# EAGLE design power_module (EAGLE 4.16)
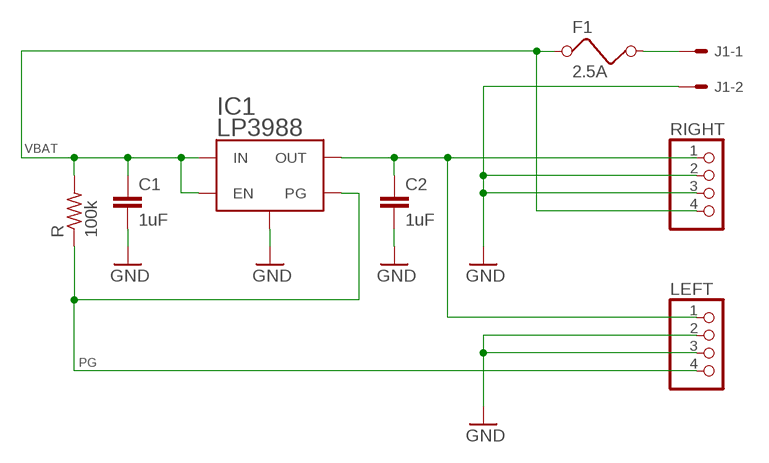
[diagram p0: schematic, sheet 1]

## Parts
C1  1uF  C-EUC3216  [C3216]
C2  1uF  C-EUC3216  [C3216]
F1  2.5A  POLYSWITCH_5MM  [POLYSWITCH_5MM]
IC1  LP3988  [SOT-23-5]
J1  S2P-S  [2P-S]
LEFT  PINHD-1X4  [1X04]
R  100k  R-US_R2012  [R2012]
RIGHT  PINHD-1X4  [1X04]

## Nets
GND: C1.2 C2.2 IC1.P$2(GND) J1.2 LEFT.2 LEFT.3 RIGHT.2 RIGHT.3
N$1: C2.1 IC1.P$5(OUT) LEFT.1 RIGHT.1
N$2: F1.P$2 J1.1
PG: IC1.P$4(PG) LEFT.4 R.1
VBAT: C1.1 F1.P$1 IC1.P$1(IN) IC1.P$3(EN) R.2 RIGHT.4

## Library data of the parts
C1 C2 = rcl:C-EU: CAPACITOR, European symbol
F1 = ptc_tyco:POLYSWITCH_5MM
IC1 = v-regulator_lp3988:LP3988
J1 = 1-conn-jst:S2P
LEFT RIGHT = pinhead:PINHD-1X4: PIN HEADER
R = rcl:R-US_: RESISTOR, American symbol

## Board
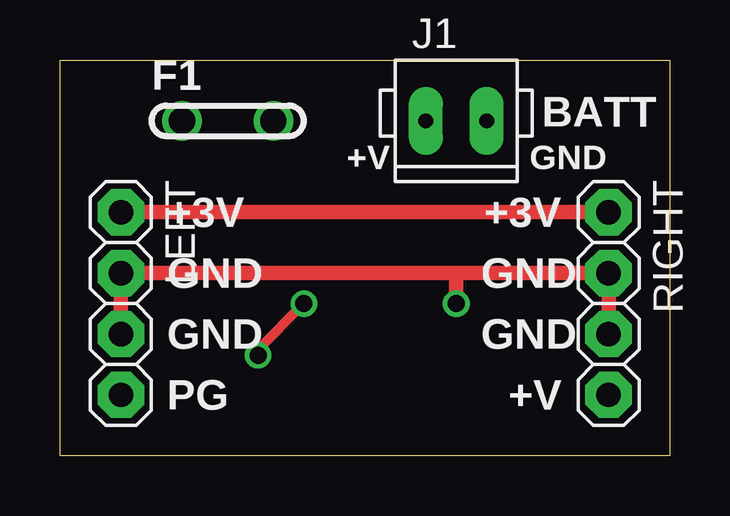
[diagram p1: board, top side]
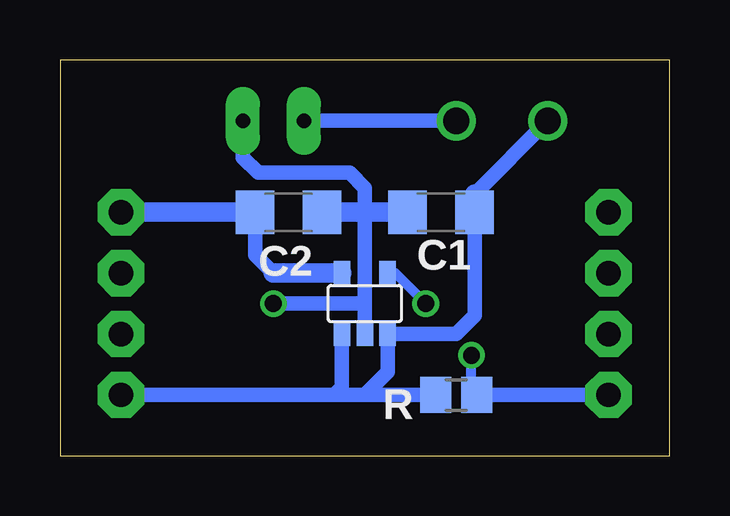
[diagram p2: board, bottom side, seen from below]

Size 25.4 x 16.51 mm. Coordinates in mm from the lower left corner, seen from the top.
Outline: 0,0 0,16.51 25.4,16.51 25.4,0 0,0
Copper layers (1*16): Top 0.035mm / dielectric 1.5mm / Bottom 0.035mm
Design rules "8mils": minimum track width 10mil, minimum drill 24mil, track to track 8mil, track to pad 8mil, pad to pad 8mil, via to via 8mil, smd to smd 8mil, copper to edge 40mil, drill to drill 10mil, minimum pad ring 10mil, minimum via ring 8mil, stop-mask expansion 0mil, vias tented up to drill 0mil, thermal gap 10mil

### Footprints (pad centres in the part's own frame; a part is rotated, then mirrored left to right if it is on the bottom)
C3216 = smd 1.6 x 1.8: 1 -1.4,0; 2 1.4,0
POLYSWITCH_5MM = drill 1.092 round: P$1 -1.27,0; P$2 2.54,0
SOT-23-5 = smd 0.686 x 0.991: P$1 -0.953,-1.27; P$2 0,-1.27; P$3 0.953,-1.27; P$4 0.953,1.27; P$5 -0.953,1.27
2P-S = drill 0.61 pad 1.422 long: 1 -1.27,0; 2 1.27,0
1X04 = drill 1.016 pad 1.93 octagon: 1 -3.81,0; 2 -1.27,0; 3 1.27,0; 4 3.81,0
R2012 = smd 1.3 x 1.5: 1 -0.85,0; 2 0.85,0

### Placement (x,y rotation side)
C1  9.53,10.16 180 bottom
C2  15.88,10.16 0 bottom
F1  6.35,13.97 0 top
IC1  12.7,6.35 0 bottom
J1  16.51,13.97 0 top
LEFT  2.54,6.35 270 top
R  8.89,2.54 180 bottom
RIGHT  22.86,6.35 270 top

### Tracks (layer width: path | path; a pad name or v marks a point on that pad's centre or on a via)
GND  (via drill 0.7)
  Top 0.61: LEFT.3 LEFT.2 16.51,7.62 | RIGHT.3 RIGHT.2 16.51,7.62 | 16.51,7.62 v16.51,6.35
  Bottom 0.61: 12.7,6.35 IC1.P$2 | 12.7,6.35 12.7,10.16 12.7,11.18 13.34,11.81 17.14,11.81 17.78,12.45 J1.2 | v16.51,6.35 12.7,6.35
  Bottom 0.813: C2.2 12.7,10.16 C1.2
N$1
  Top 0.61: LEFT.1 RIGHT.1
  Bottom 0.61: C2.1 17.27,8.38 16.51,7.62
  Bottom 0.813: 16.51,7.62 IC1.P$5 | RIGHT.1 C2.1
N$2
  Bottom 0.61: J1.1 F1.P$2
PG  (via drill 0.7)
  Top 0.406: v8.25,4.19 8.25,4.45 v10.16,6.35
  Bottom 0.406: IC1.P$4 11.43,7.62 v10.16,6.35 | R.1 8.25,2.54 v8.25,4.19
  Bottom 0.61: LEFT.4 R.1
VBAT
  Bottom 0.61: C1.1 8.12,5.84 8.89,5.08 IC1.P$3 11.75,3.49 12.7,2.54 | 12.7,2.54 13.97,2.54 | 13.97,2.54 RIGHT.4 | IC1.P$1 13.65,2.86 13.97,2.54 | R.2 12.7,2.54 | 8.12,10.93 F1.P$1
  Bottom 0.813: C1.1 8.12,10.93

### Text on the board
tNames: BATT | +V | GND | +3V | +3V | GND | GND | GND | GND | PG | +V